# EasyEDA schematic ledring-final(easyEDA).json

## Sheets
1 Connections to Outside World: TITLE: Connections; REV: 1.0; Date: 2020-01-10; Sheet: 1/1; Drawn By: mbk7; Company: superLab(2020)
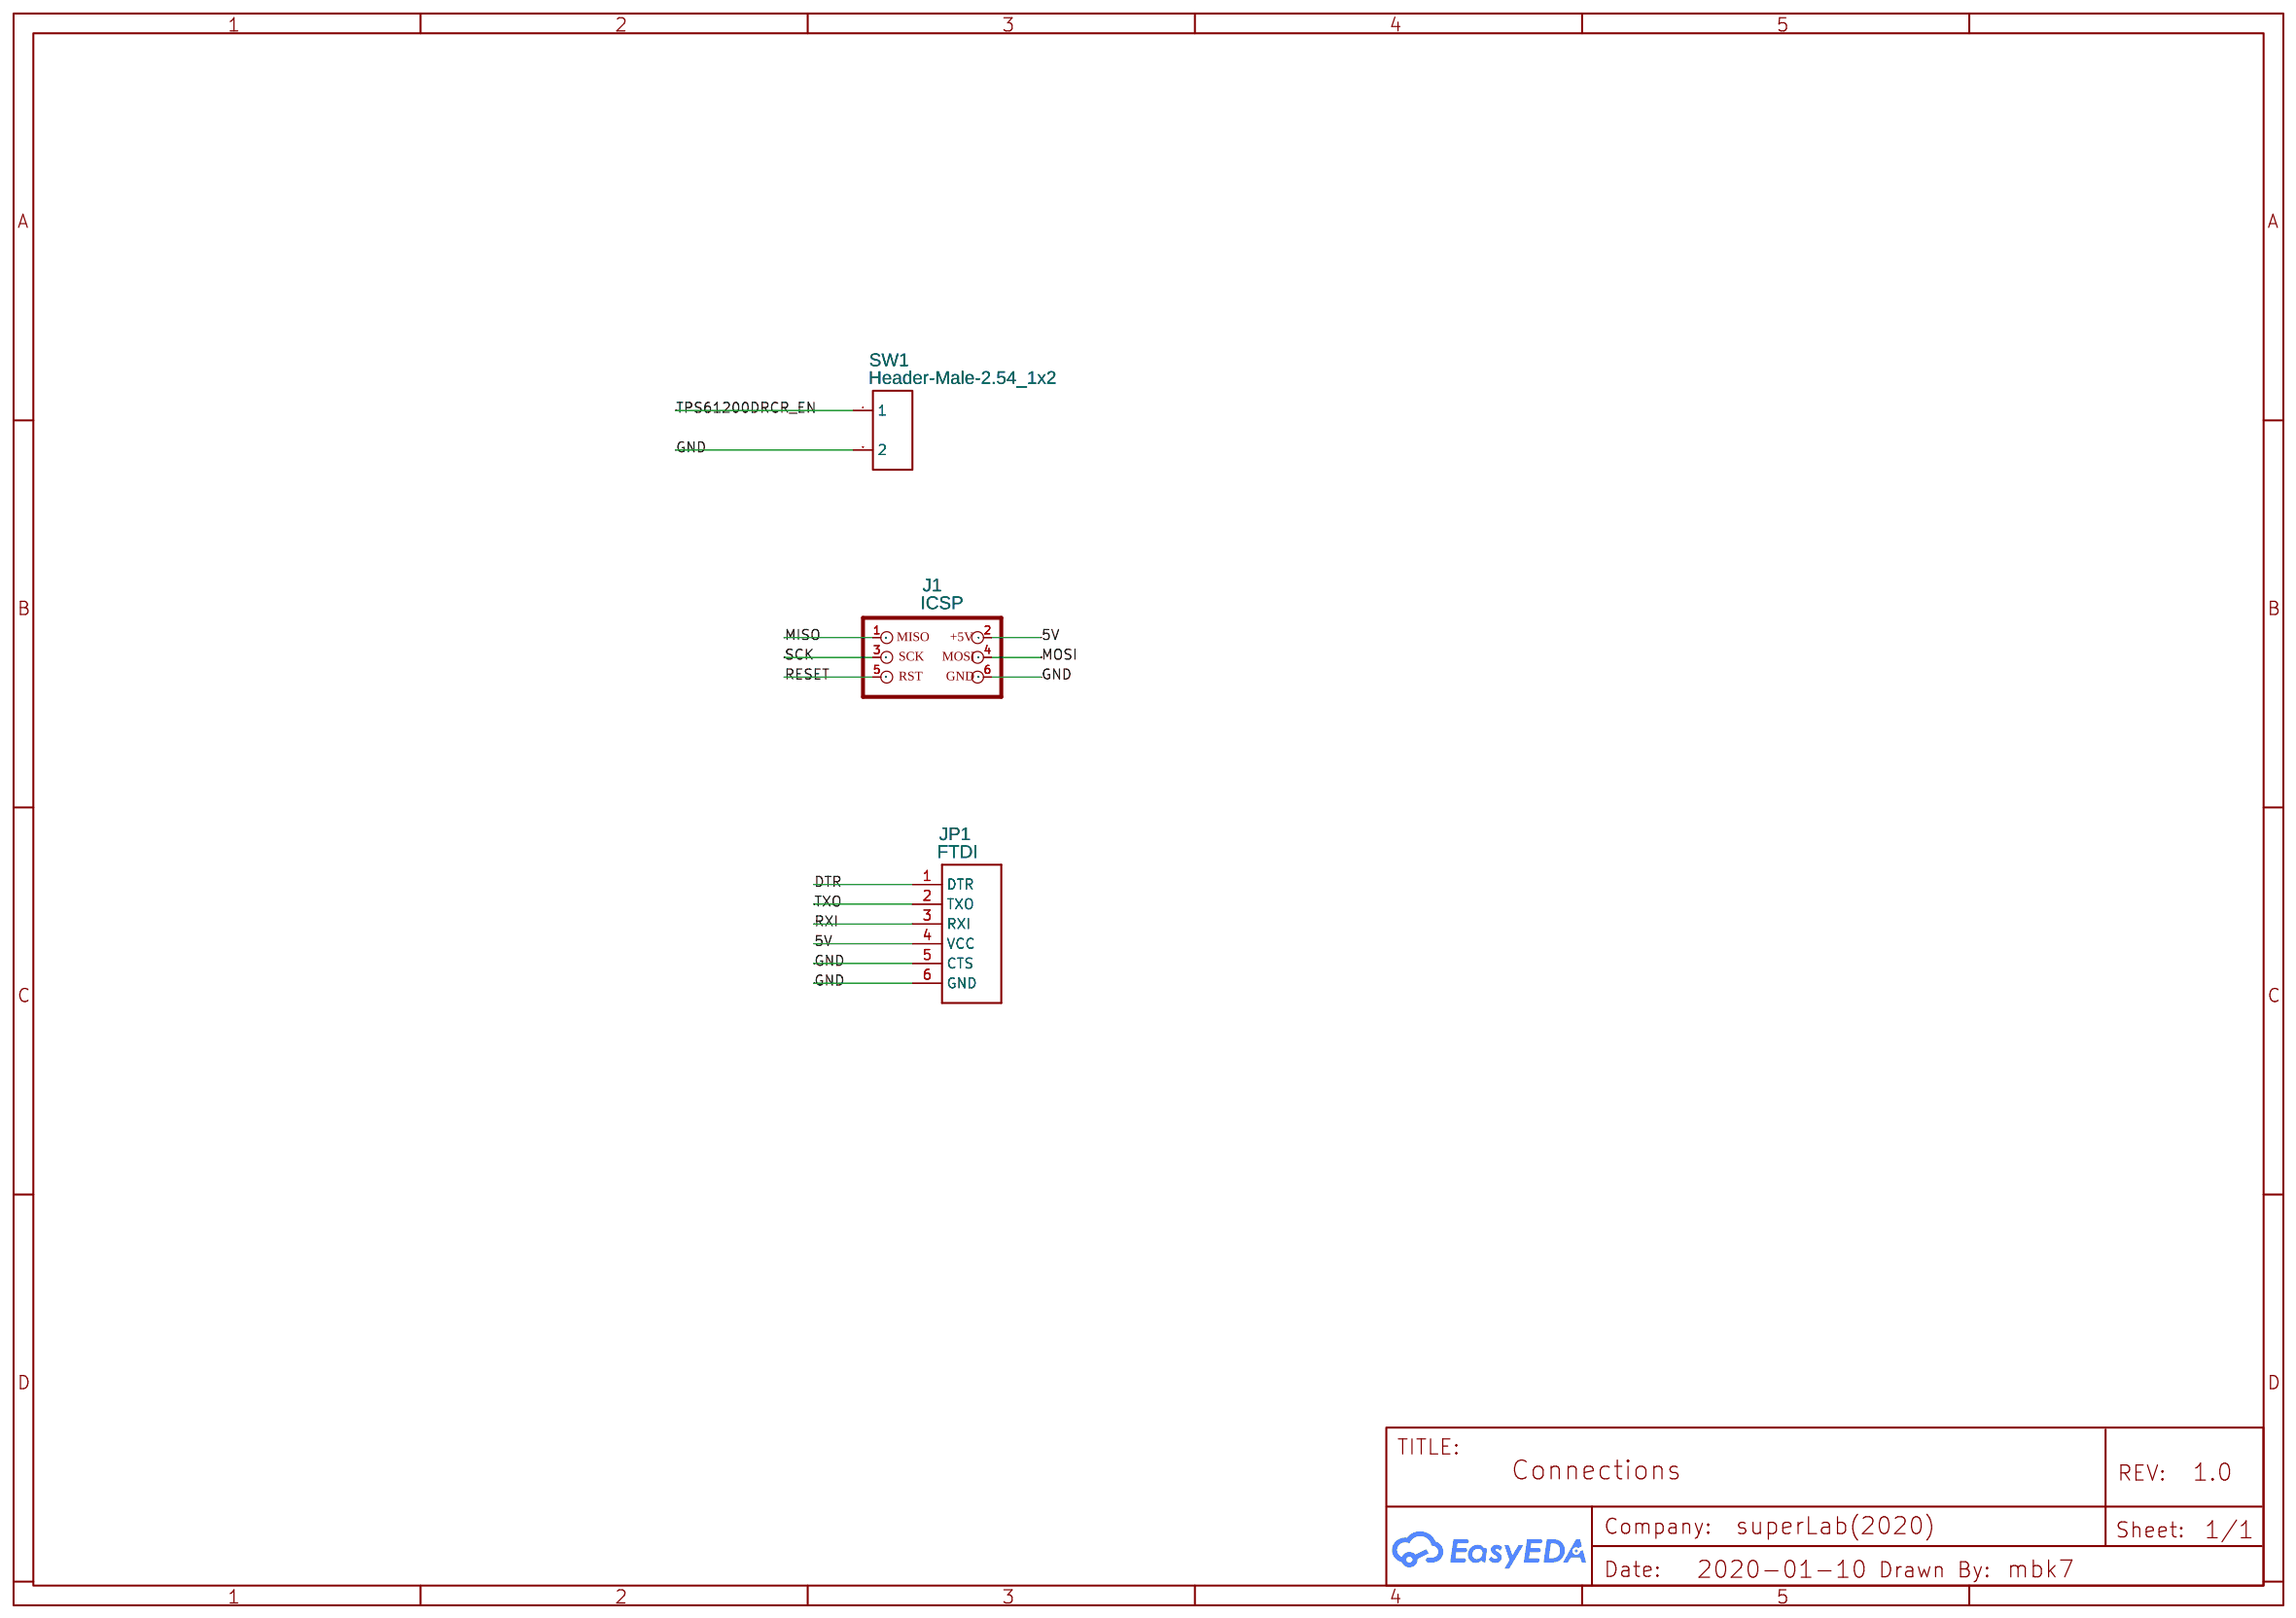
[diagram p0: Connections to Outside World]
2 Arduino: TITLE: Arduino Pro Mini
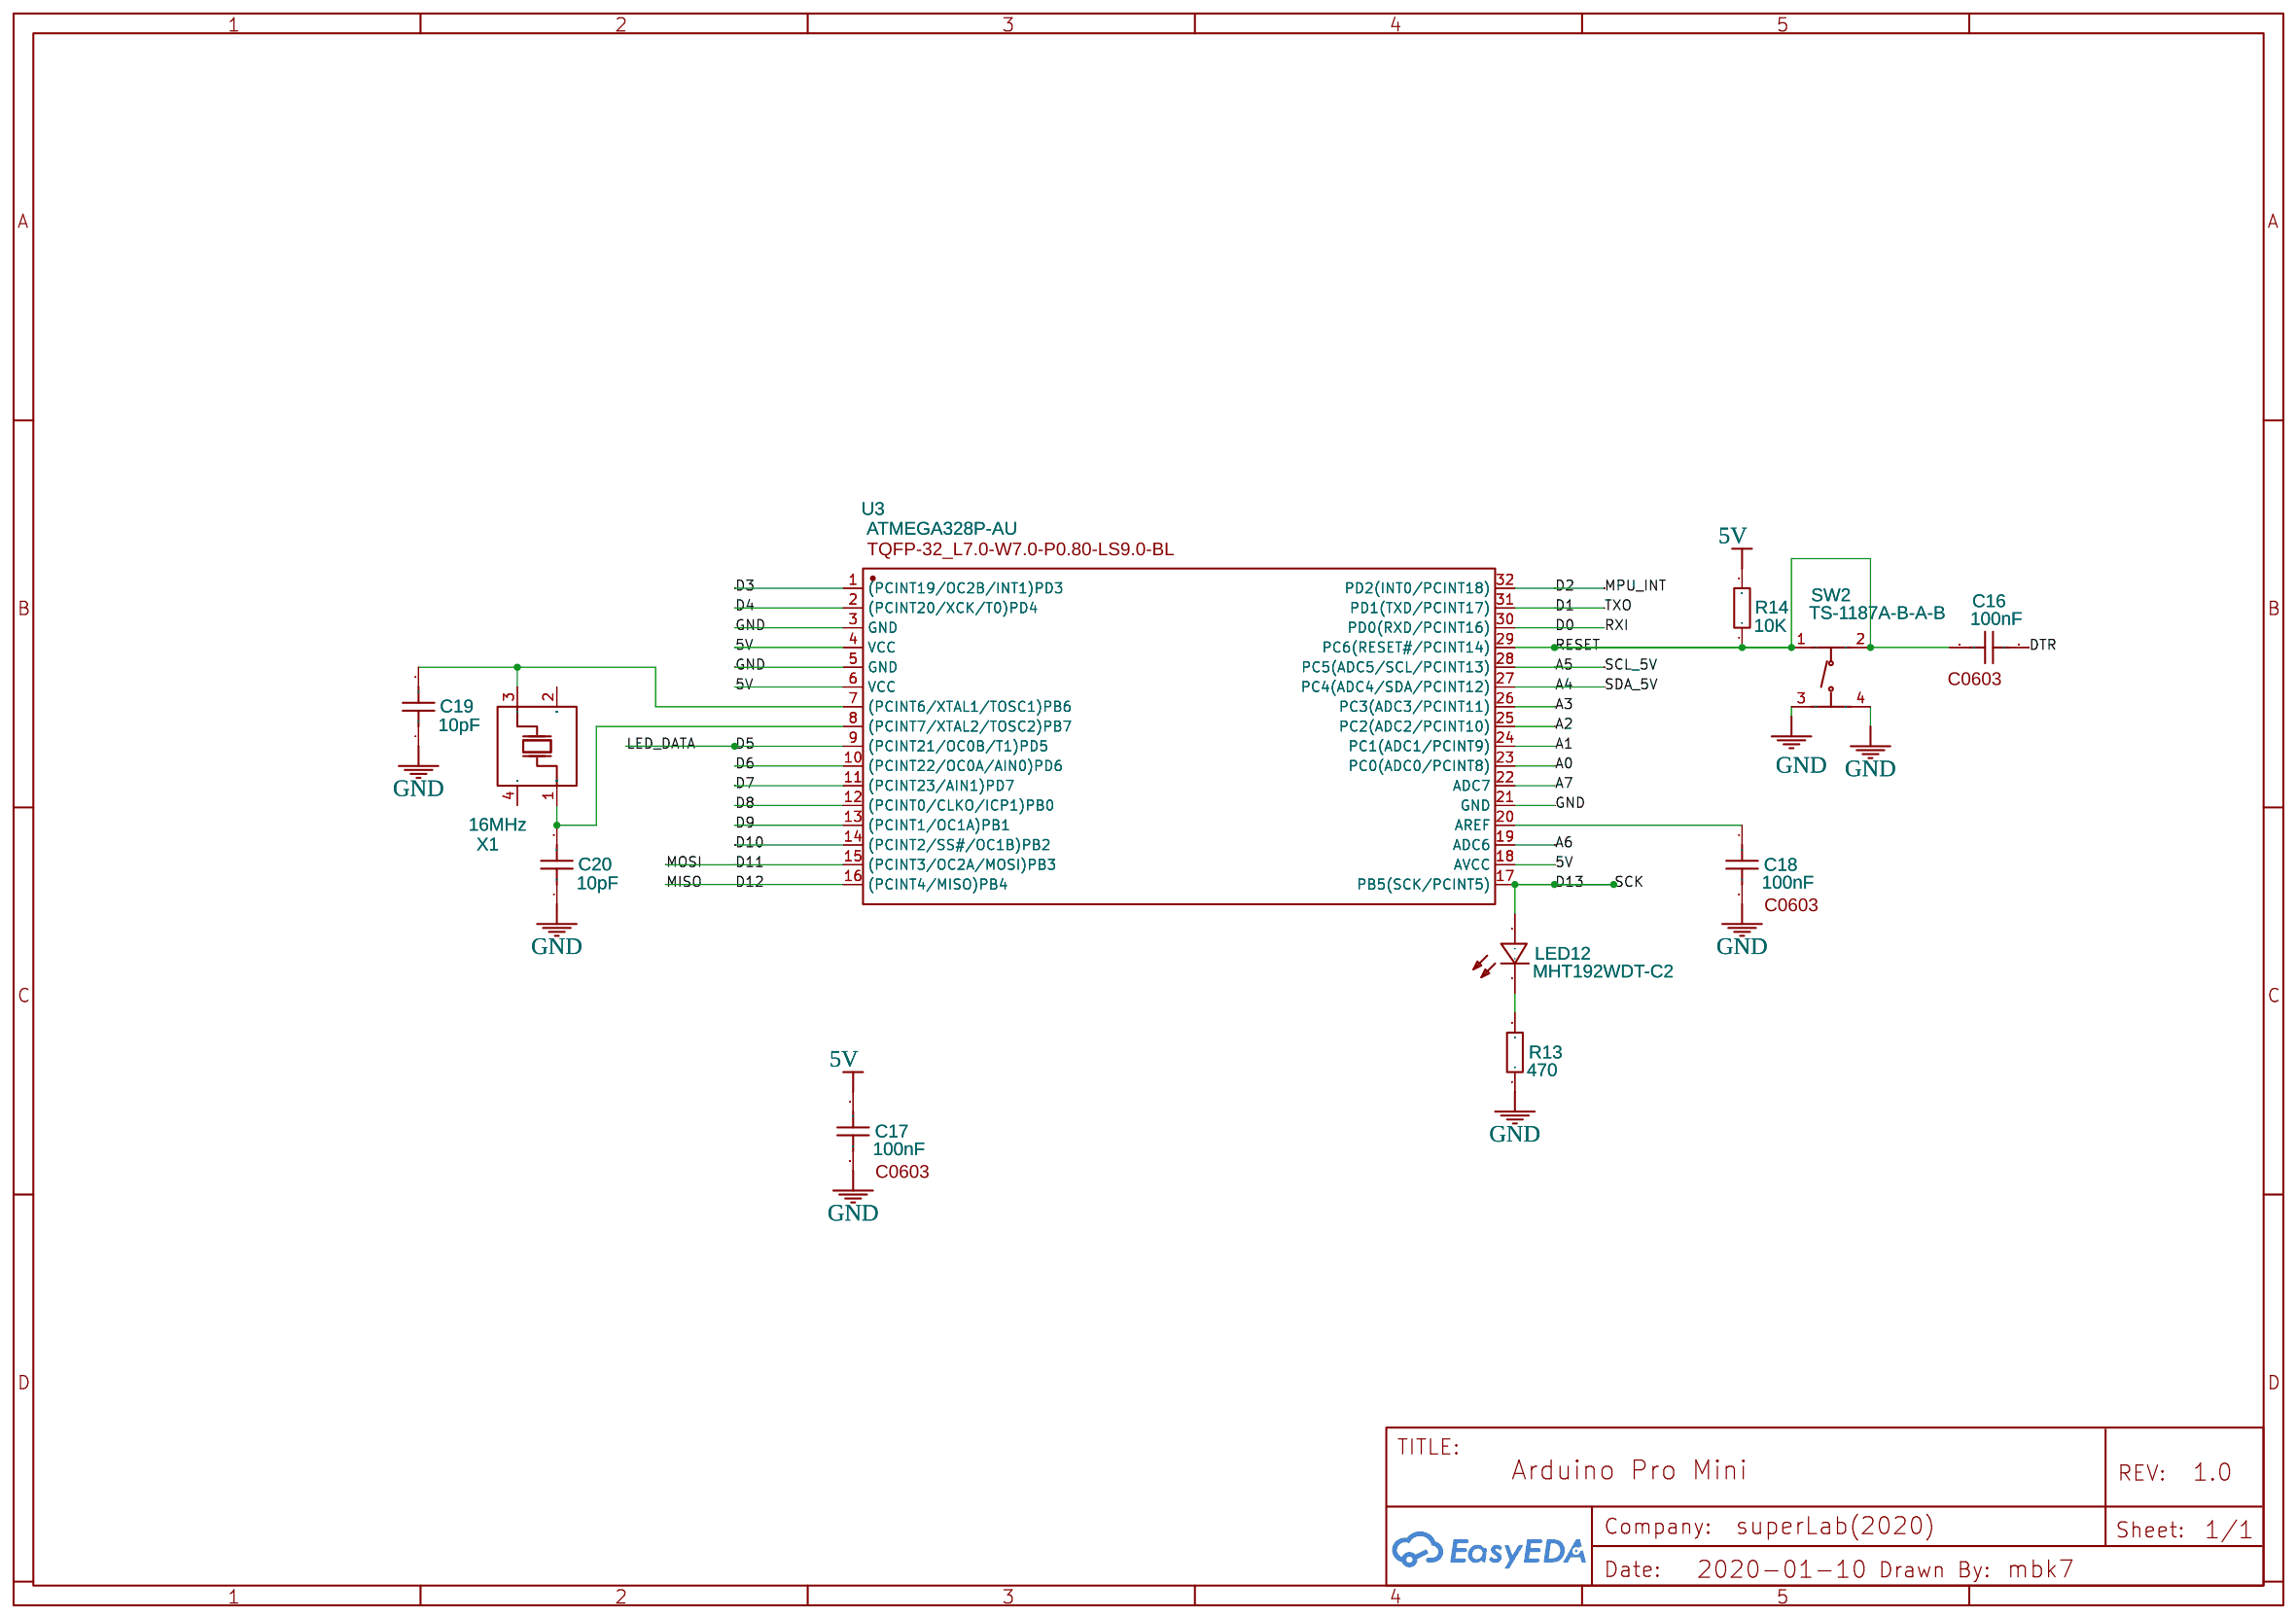
[diagram p1: Arduino]
3 I2C Shifting: TITLE: I2C Voltage Shifting
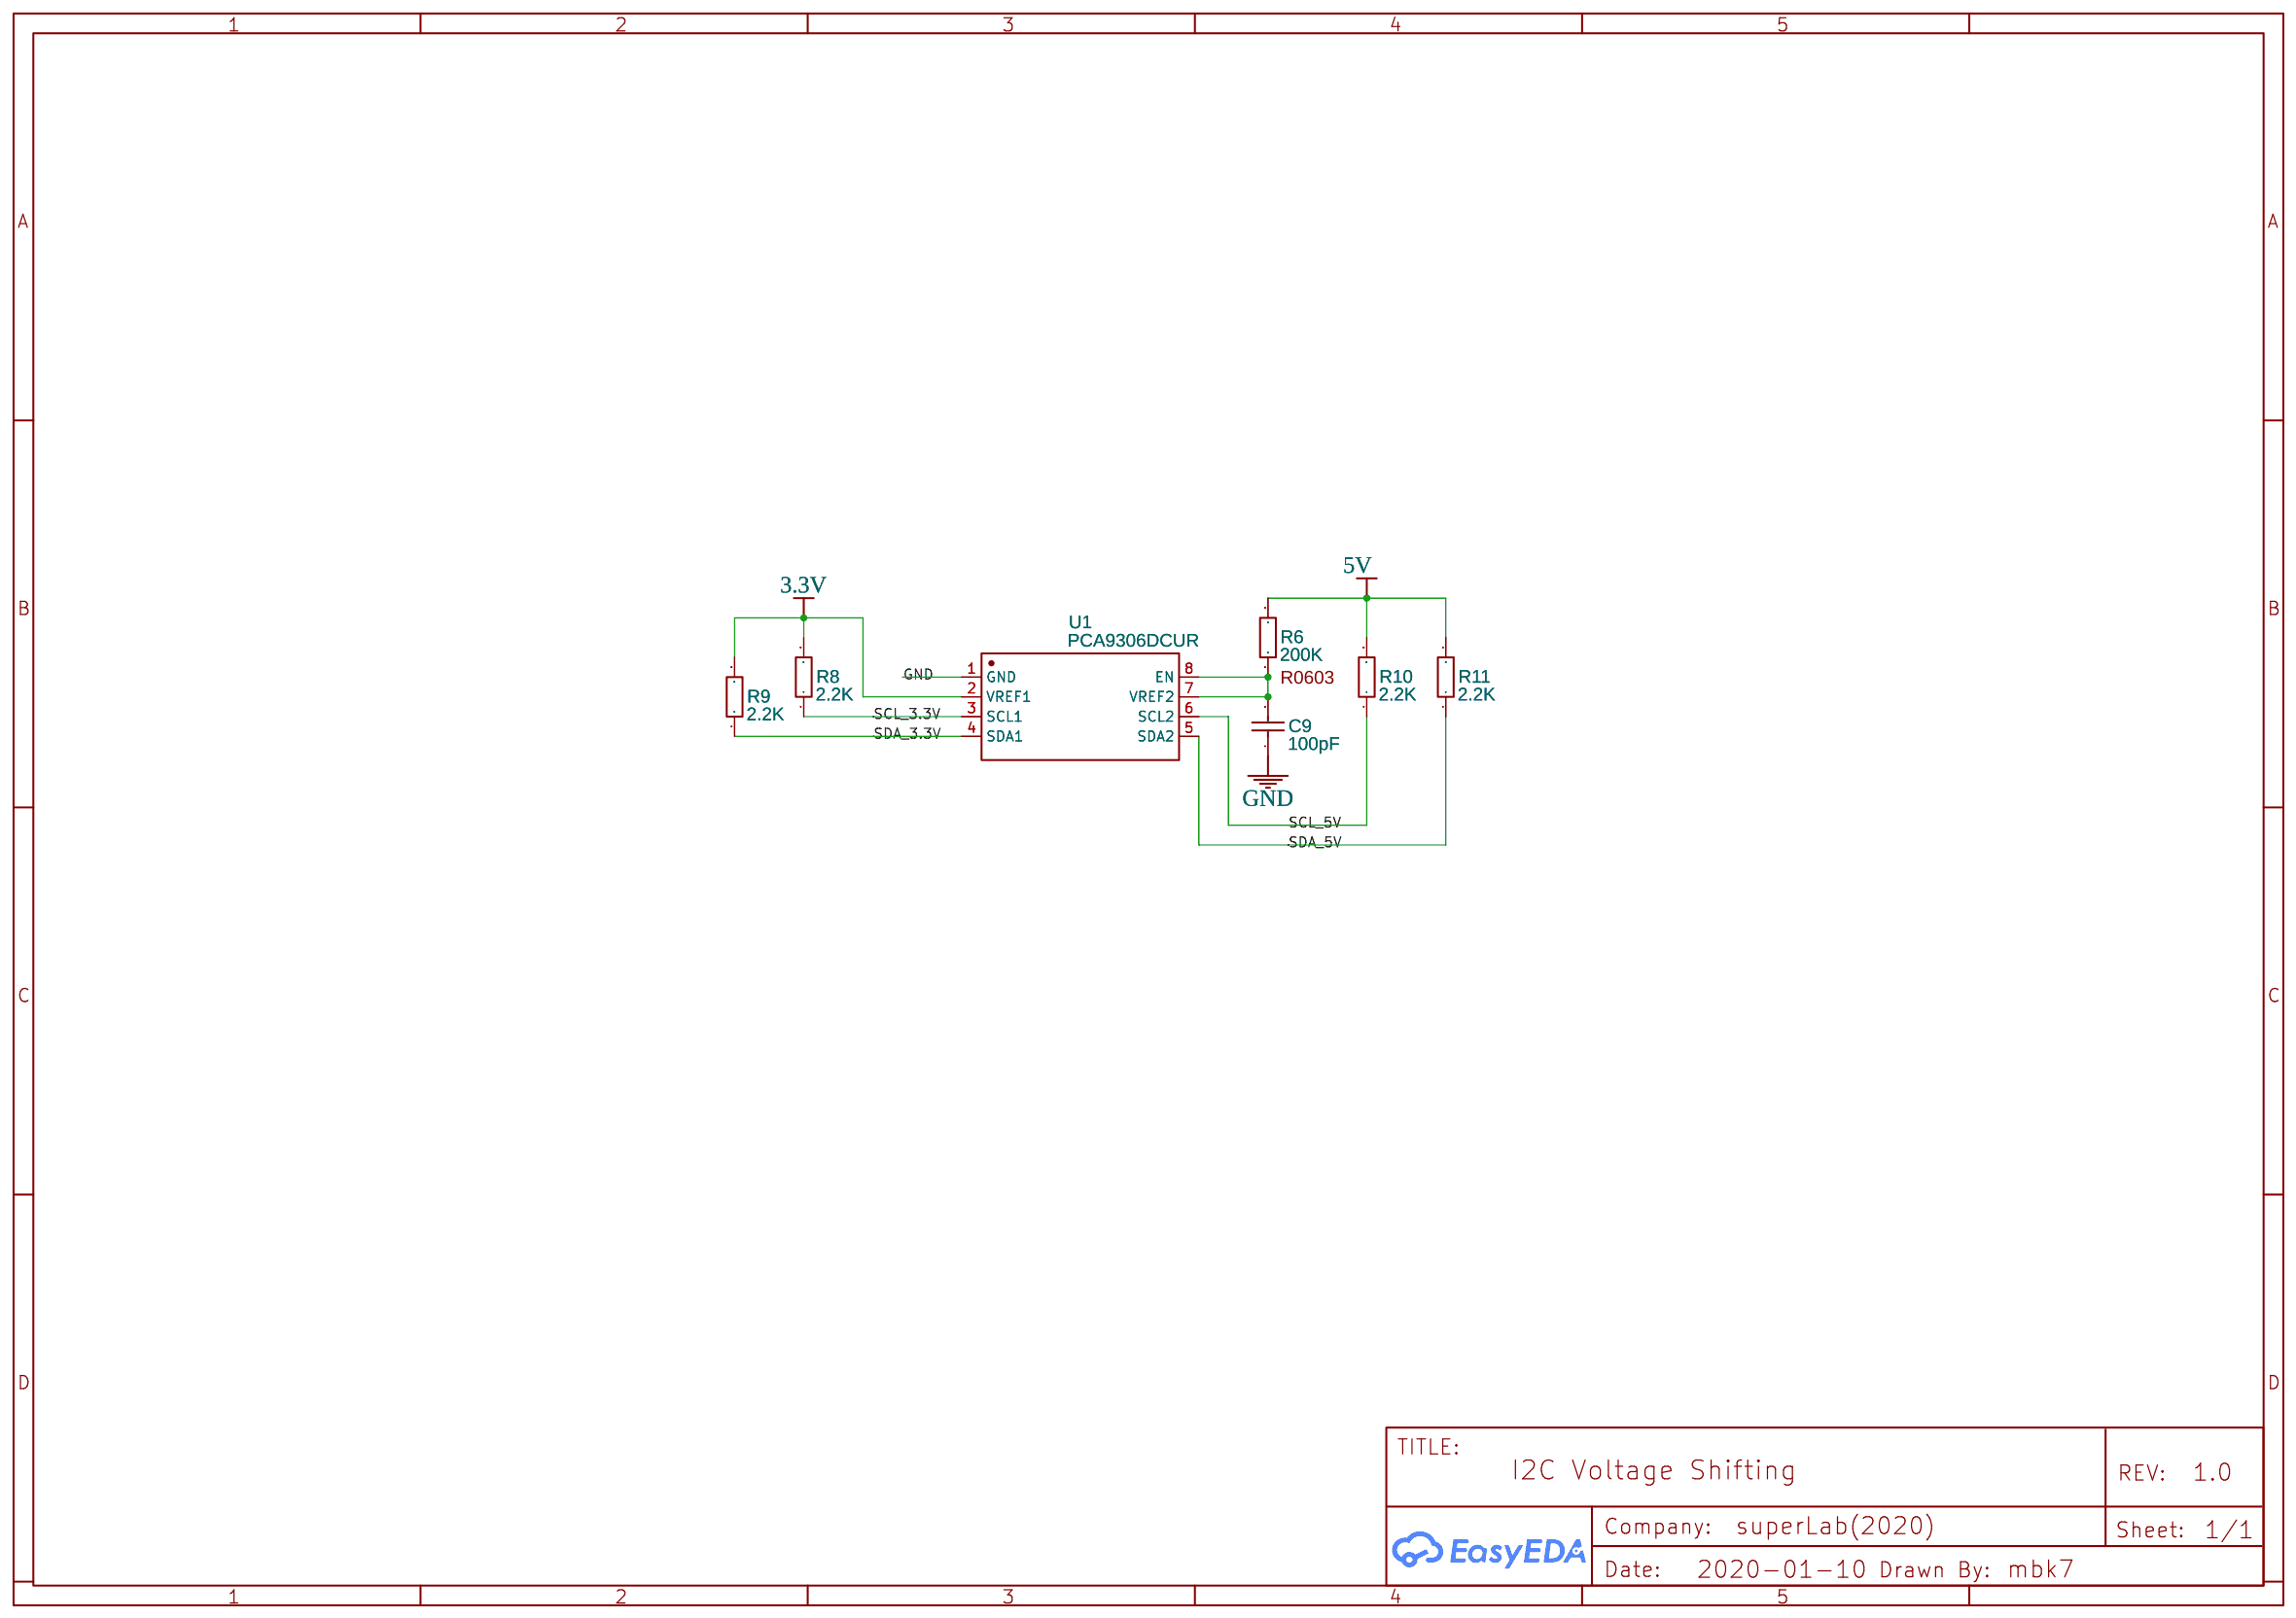
[diagram p2: I2C Shifting]
4 LEDs: TITLE: Neopixels
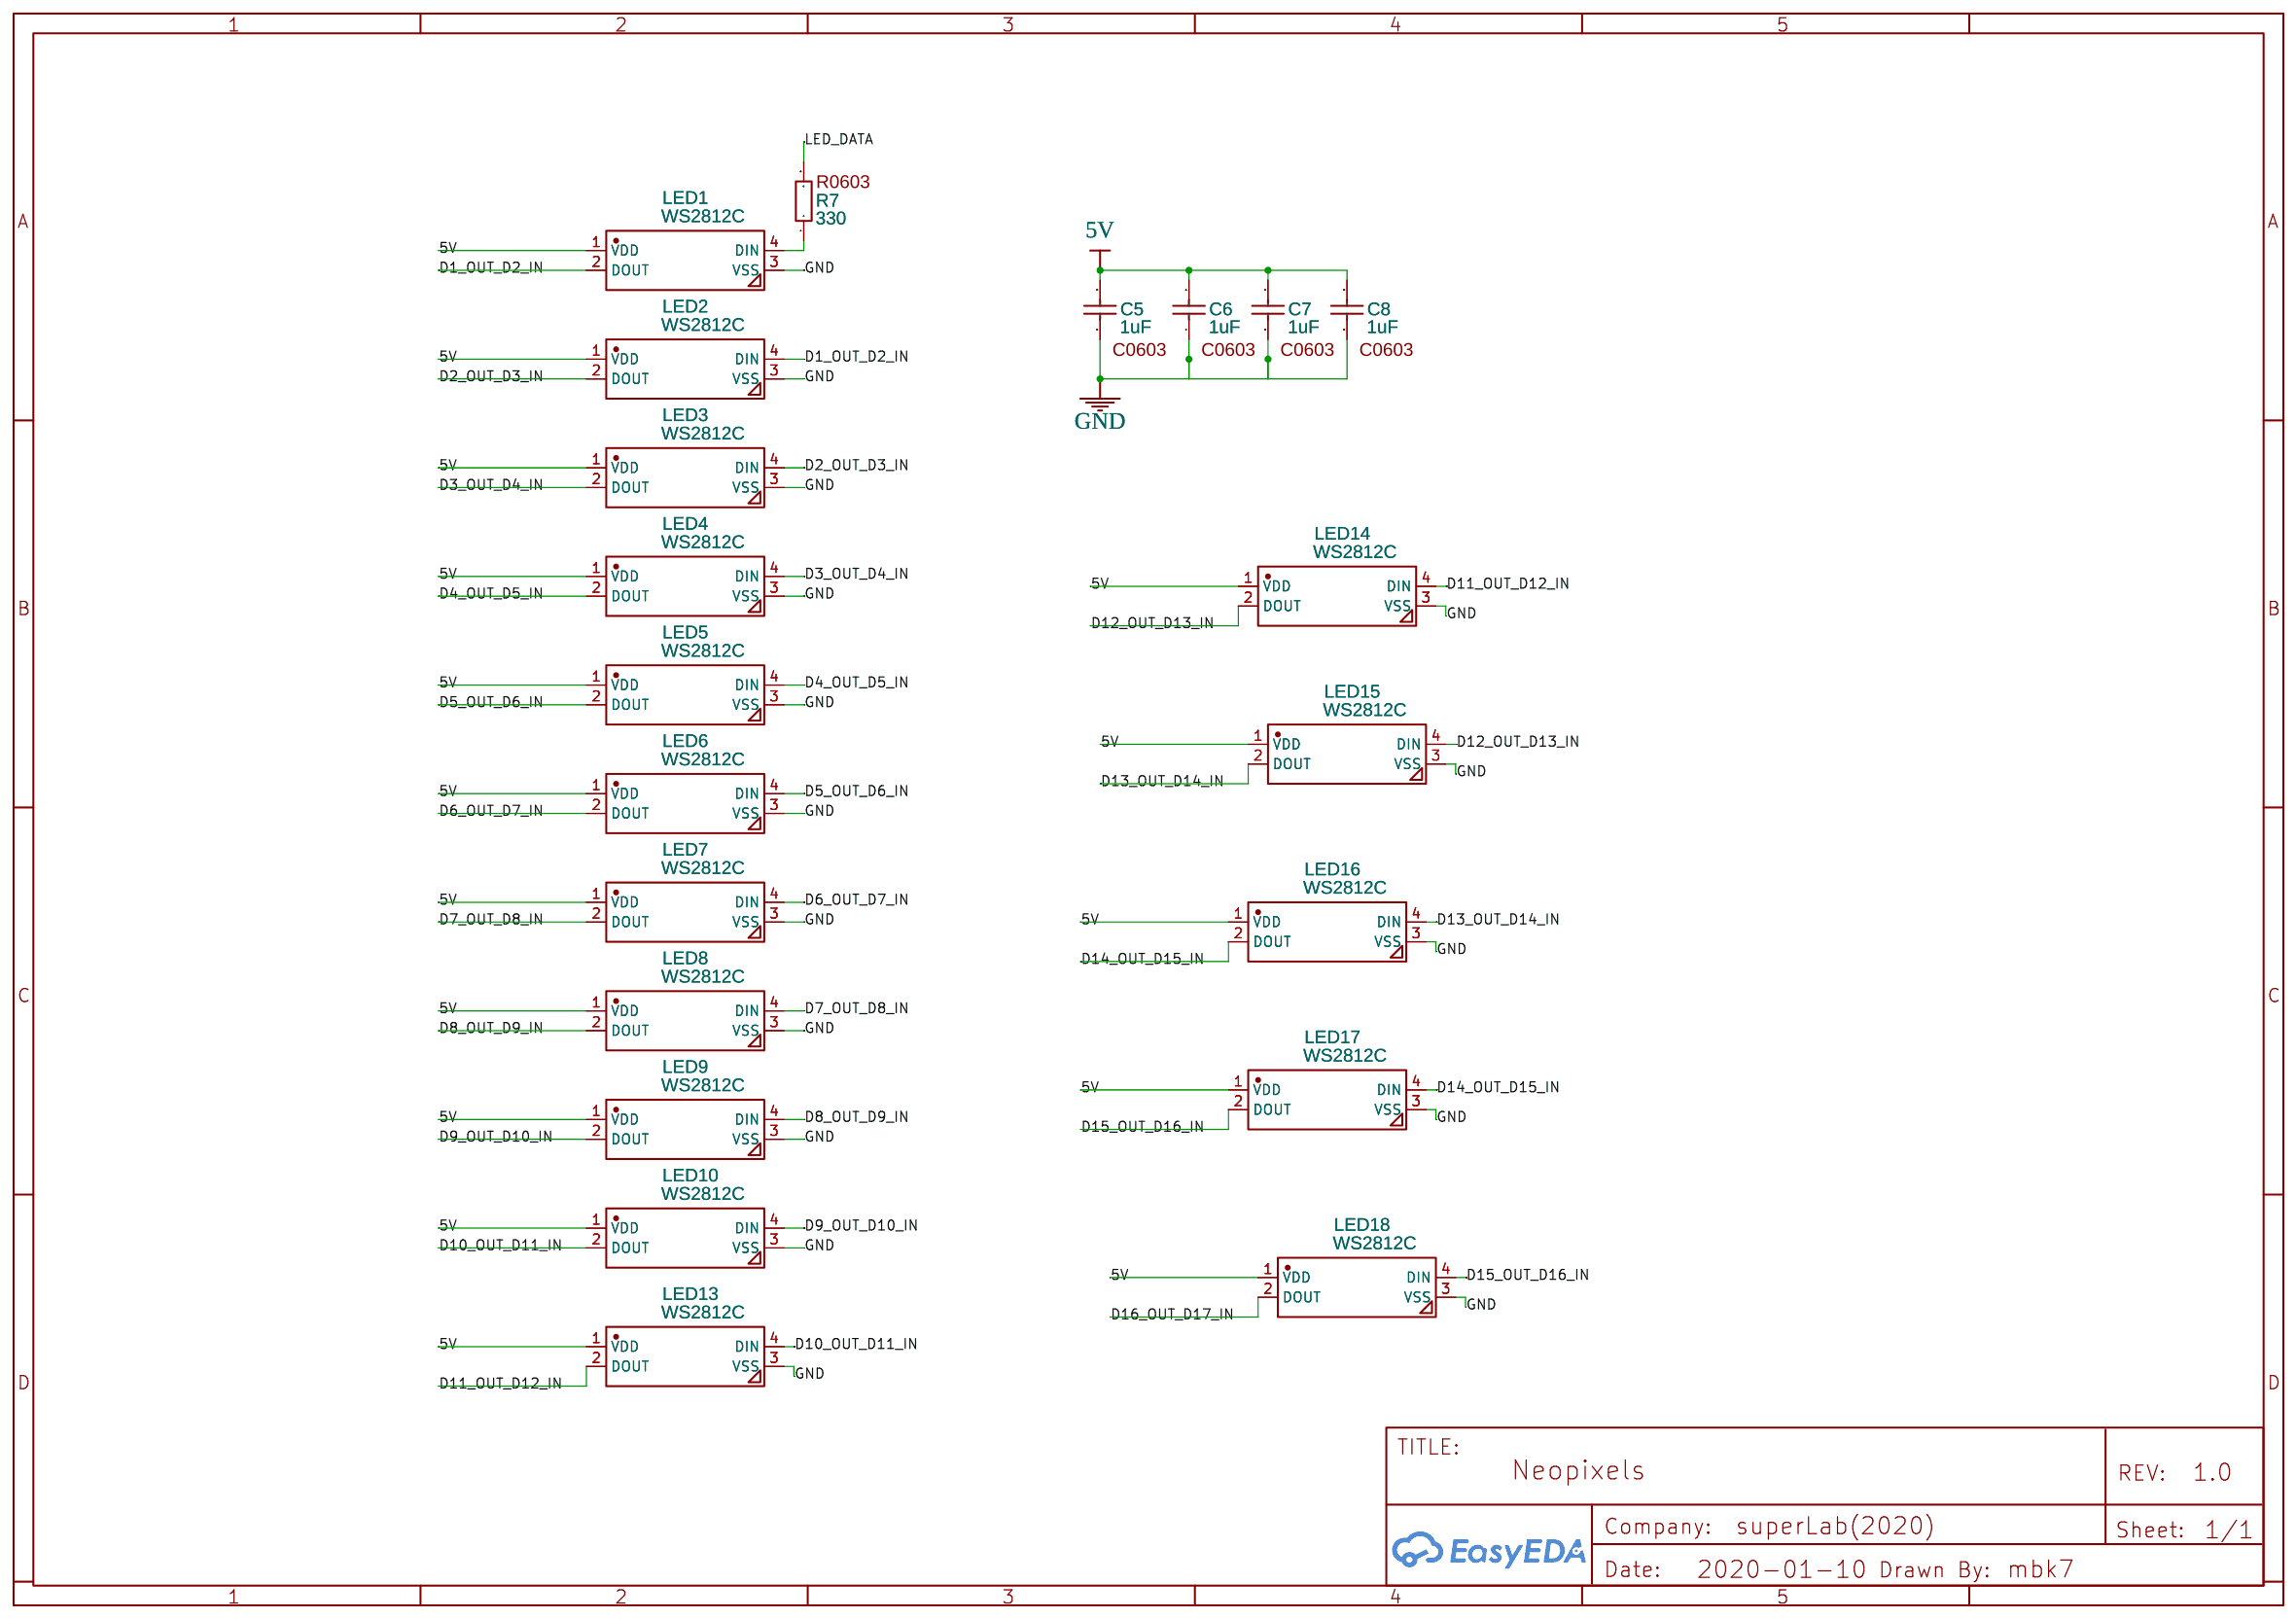
[diagram p3: LEDs]
5 MPU-6050: TITLE: MPU-6050
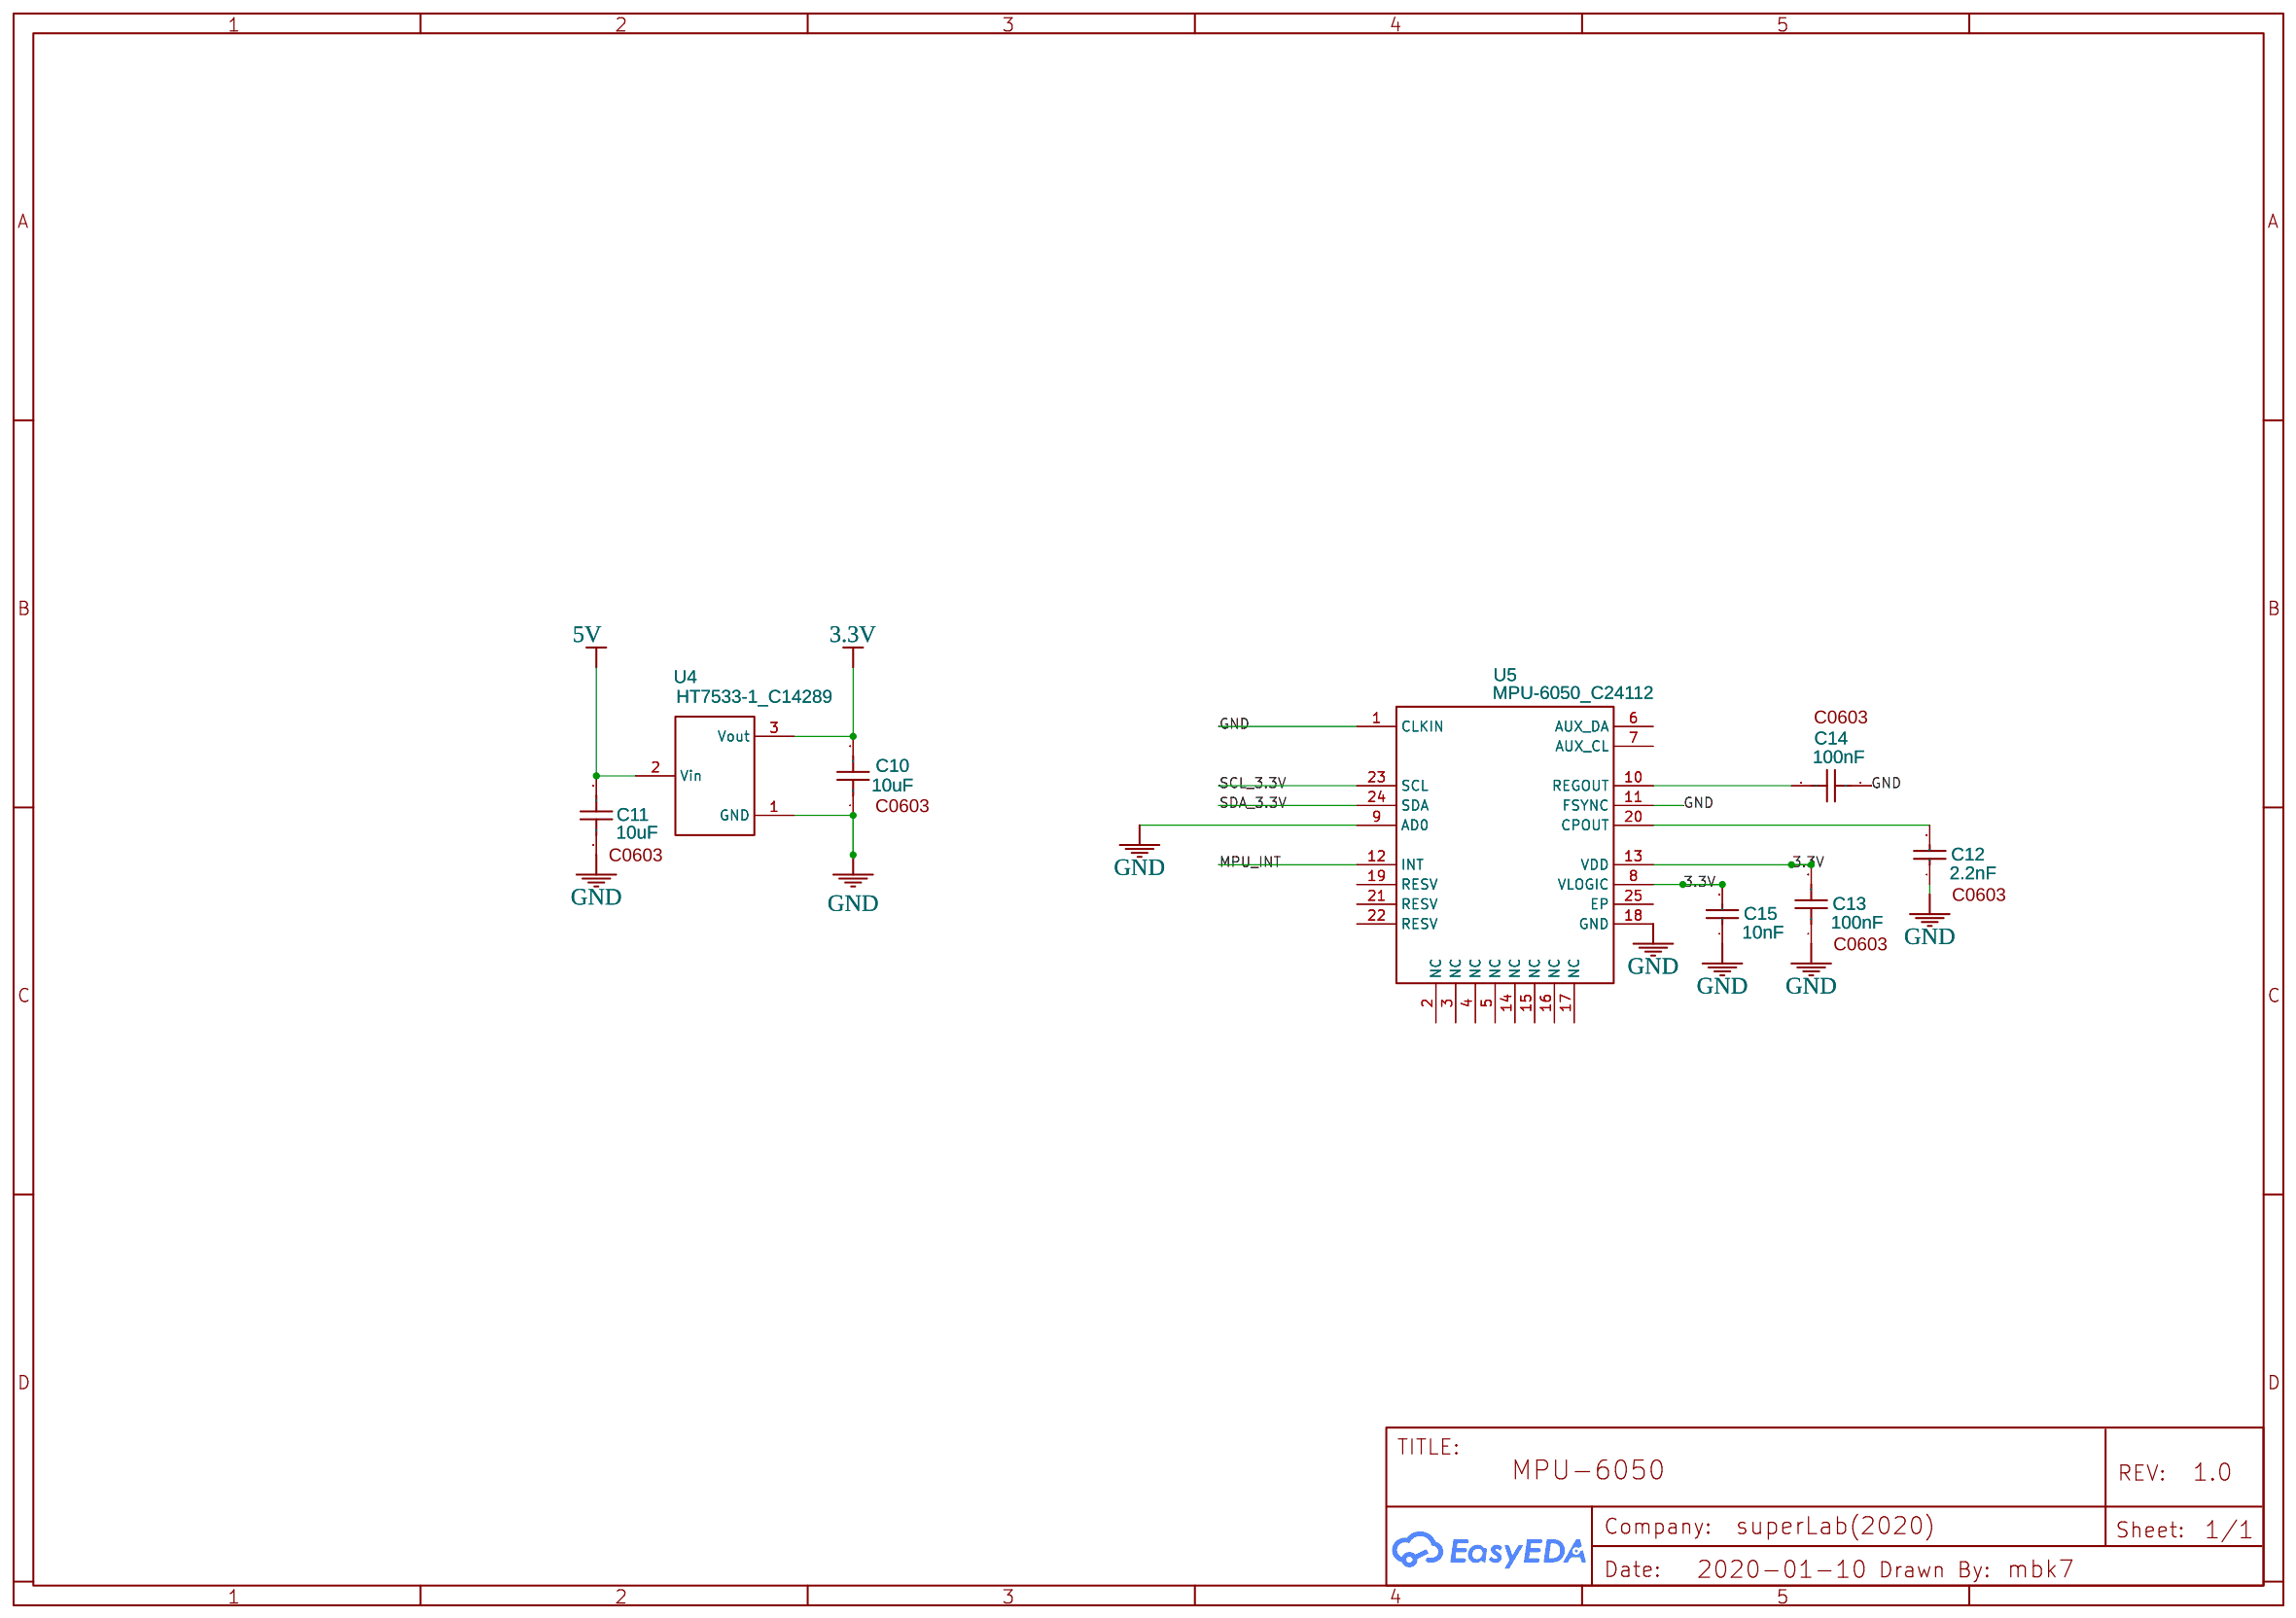
[diagram p4: MPU-6050]
6 Boost Power Supply: TITLE: Boost Power Supply
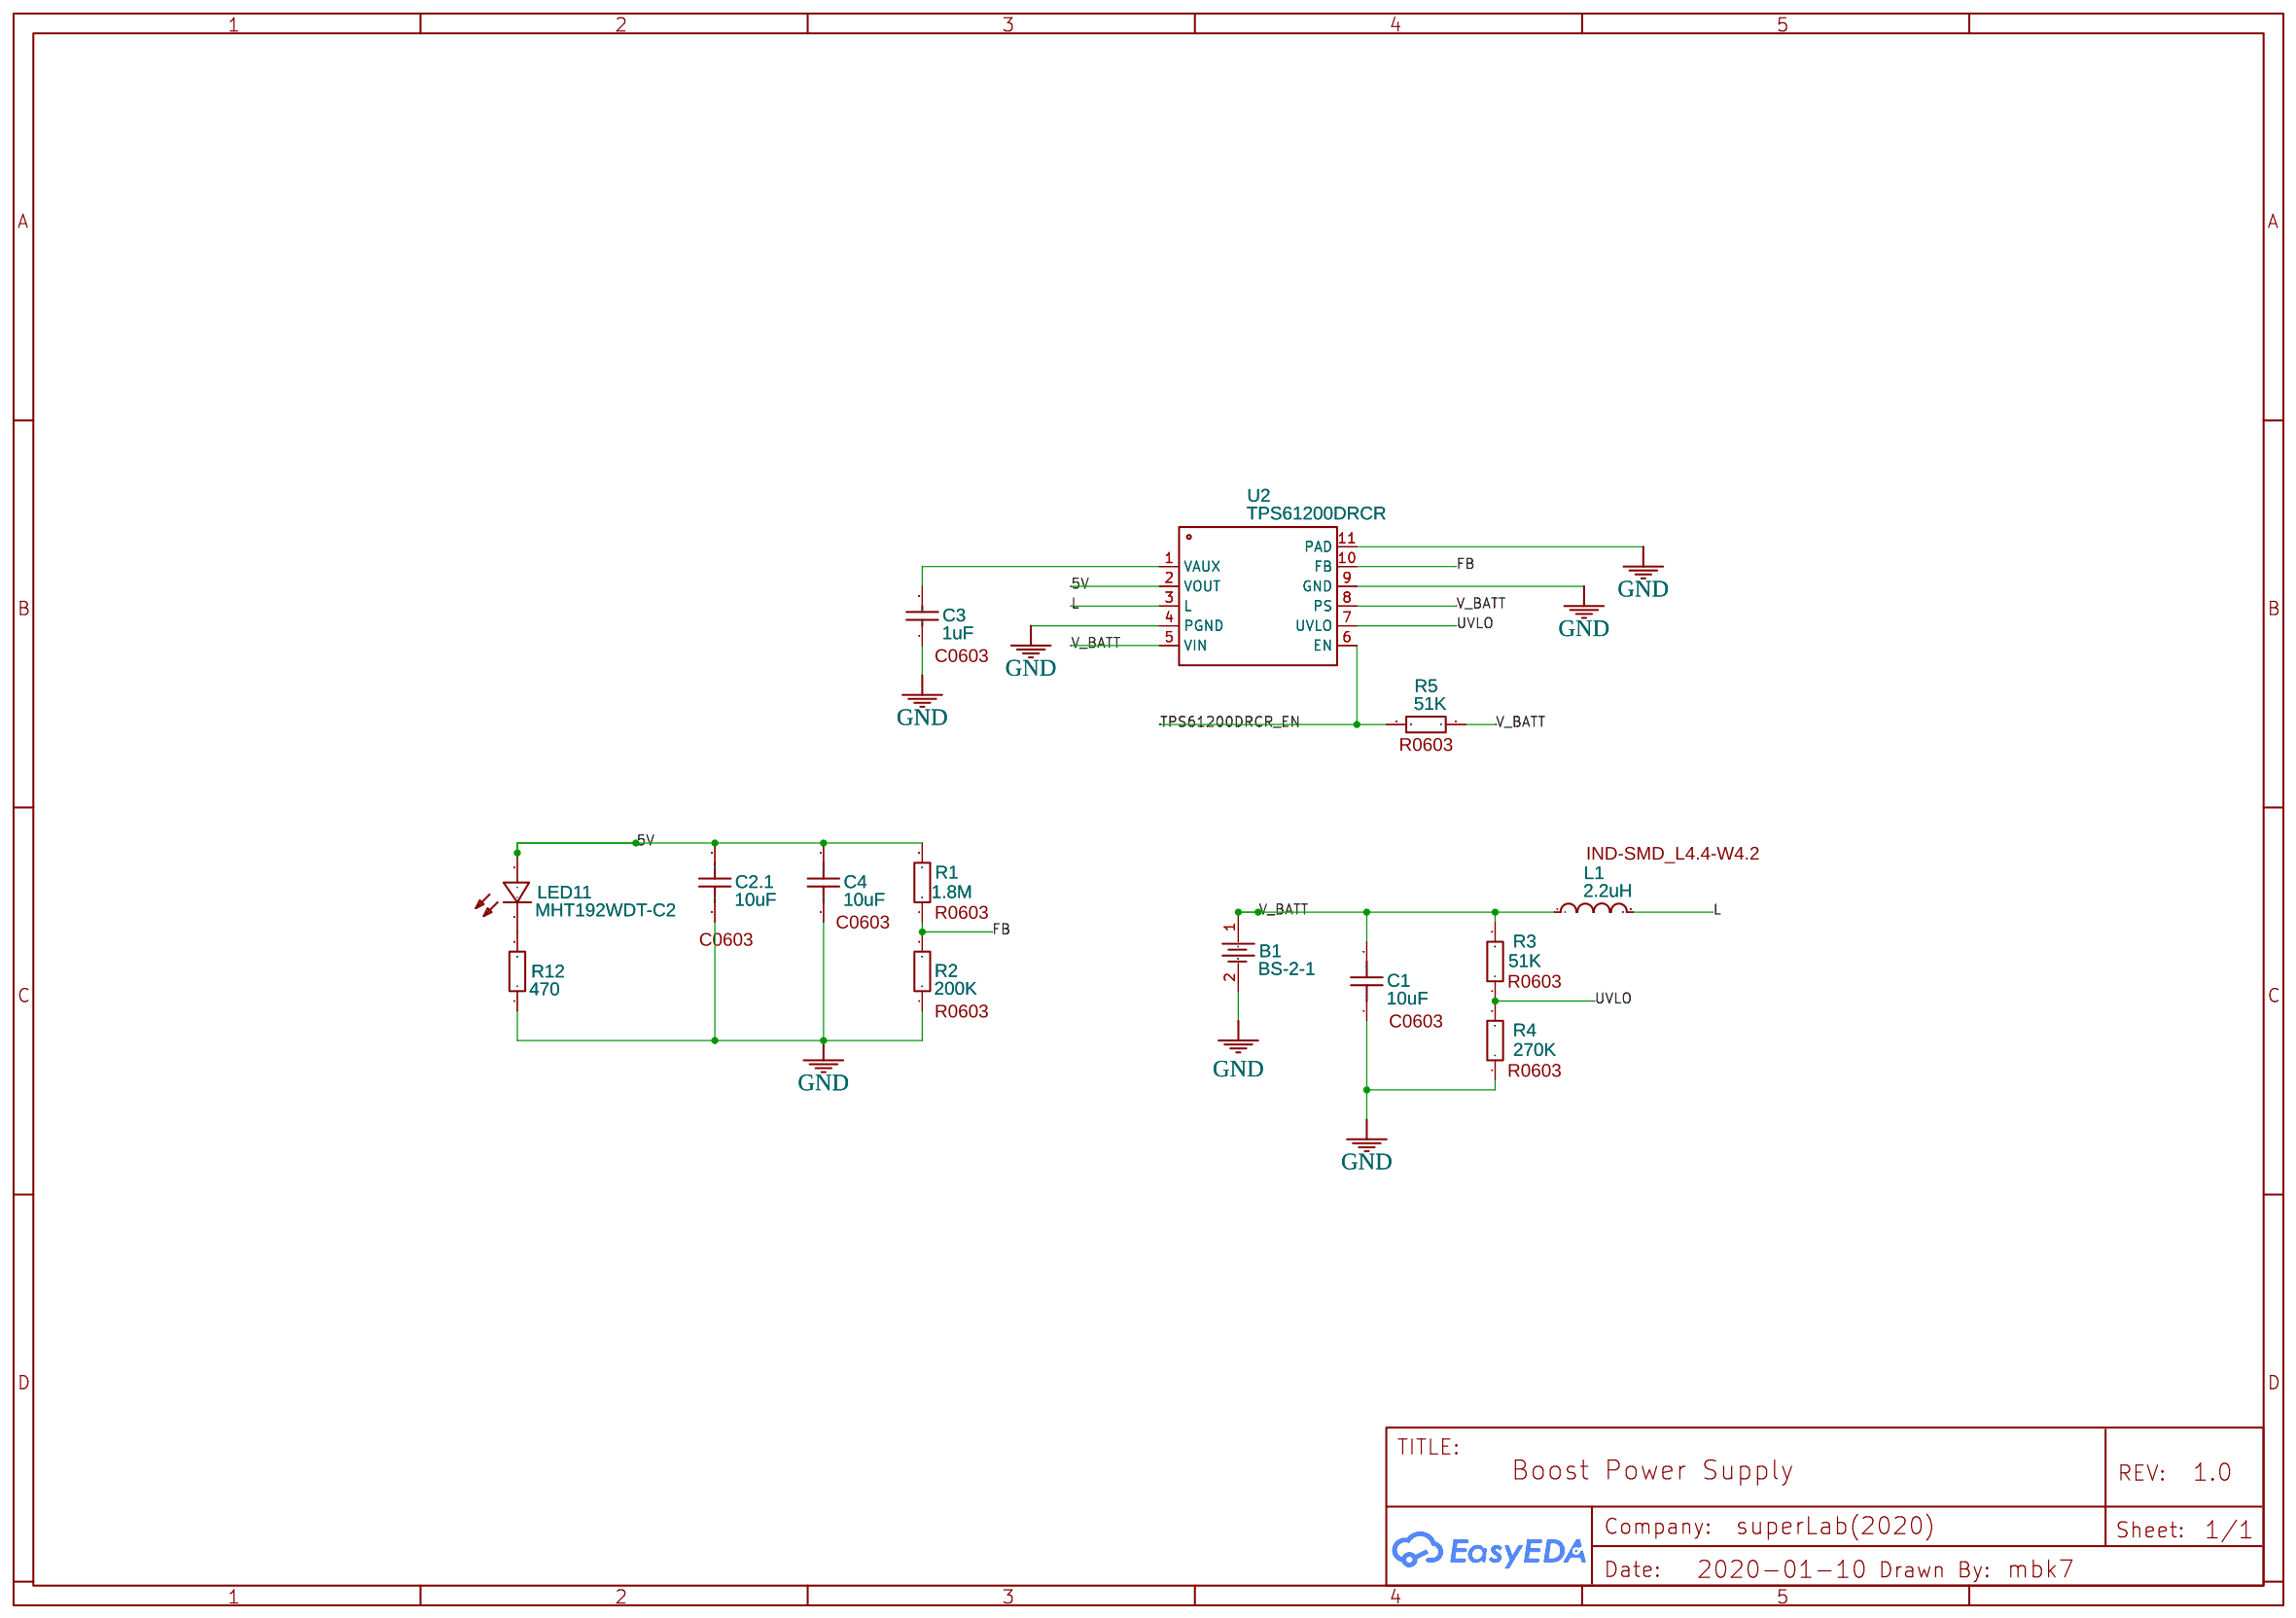
[diagram p5: Boost Power Supply]

## Parts
sheet Arduino
C16  100nF  [C0603]
C17  100nF  [C0603]
C18  100nF  [C0603]
C19  10pF  [C0402]
C20  10pF  [C0402]
LED12  MHT192WDT-C2  [LED0603-RD]
R13  470  [R0603]
R14  10K  [R0603]
SW2  TS-1187A-B-A-B  [SW-SMD_4P-L5.1-W5.1-P3.70-LS6.4]
U3  ATMEGA328P-AU  [TQFP-32_L7.0-W7.0-P0.80-LS9.0-BL]
X1  16MHz  [OSC-SMD_4P-L3.2-W2.5-BL]
sheet Boost Power Supply
B1  BS-2-1  [KEYSTONE_2466_1XAAA]
C1  10uF  [C0603]
C2  10uF  [C0603]  (section 1)
C3  1uF  [C0603]
C4  10uF  [C0603]
L1  2.2uH  [IND-SMD_L4.4-W4.2]
LED11  MHT192WDT-C2  [LED0603-RD]
R1  1.8M  [R0603]
R2  200K  [R0603]
R3  51K  [R0603]
R4  270K  [R0603]
R5  51K  [R0603]
R12  470  [R0603]
U2  TPS61200DRCR  [VSON-10_L3.0-W3.0-P0.50-BL-EP_TPS62410DRCR]
sheet Connections to Outside World
J1  ICSP  [HEADER_PRG_2X03]
JP1  FTDI  [FTDI]
SW1  Header-Male-2.54_1x2  [HDR-2X1/2.54]
sheet I2C Shifting
C9  100pF  [C0402]
R6  200K  [R0603]
R8  2.2K  [R0402]
R9  2.2K  [R0402]
R10  2.2K  [R0402]
R11  2.2K  [R0402]
U1  PCA9306DCUR  [VSSOP-8_L2.4-W2.1-P0.50-LS3.2-BL]
sheet LEDs
C5  1uF  [C0603]
C6  1uF  [C0603]
C7  1uF  [C0603]
C8  1uF  [C0603]
LED1  WS2812C  [LED-SMD_4P-L5.0-W5.0-BL]
LED2  WS2812C  [LED-SMD_4P-L5.0-W5.0-BL]
LED3  WS2812C  [LED-SMD_4P-L5.0-W5.0-BL]
LED4  WS2812C  [LED-SMD_4P-L5.0-W5.0-BL]
LED5  WS2812C  [LED-SMD_4P-L5.0-W5.0-BL]
LED6  WS2812C  [LED-SMD_4P-L5.0-W5.0-BL]
LED7  WS2812C  [LED-SMD_4P-L5.0-W5.0-BL]
LED8  WS2812C  [LED-SMD_4P-L5.0-W5.0-BL]
LED9  WS2812C  [LED-SMD_4P-L5.0-W5.0-BL]
LED10  WS2812C  [LED-SMD_4P-L5.0-W5.0-BL]
LED13  WS2812C  [LED-SMD_4P-L5.0-W5.0-BL]
LED14  WS2812C  [LED-SMD_4P-L5.0-W5.0-BL]
LED15  WS2812C  [LED-SMD_4P-L5.0-W5.0-BL]
LED16  WS2812C  [LED-SMD_4P-L5.0-W5.0-BL]
LED17  WS2812C  [LED-SMD_4P-L5.0-W5.0-BL]
LED18  WS2812C  [LED-SMD_4P-L5.0-W5.0-BL]
R7  330  [R0603]
sheet MPU-6050
C10  10uF  [C0603]
C11  10uF  [C0603]
C12  2.2nF  [C0603]
C13  100nF  [C0603]
C14  100nF  [C0603]
C15  10nF  [C0603]
U4  HT7533-1_C14289  [SOT-89-3_L4.5-W2.5-P1.50-LS4.2-BR]
U5  MPU-6050_C24112  [QFN-24_4X4X05P]

## Library data of the parts
C13 C14 C16-C18 = CC0603KRX7R9BB104: Supplier: LCSC; Manufacturer: YAGEO; LCSC Assembly: Yes; Supplier Part: C14663; SMT Type: Basic; Package Display: Yes
C19 C20 = CL05C100JB5NNNC: Supplier: LCSC; Manufacturer: SAMSUNG; LCSC Assembly: Yes; Supplier Part: C32949; SMT Type: Basic
LED11 LED12 = MHT192WDT-C2: Supplier: LCSC; Supplier Part: C389521; Manufacturer: MEIHUA; Contributor: LCSC
R12 R13 = 0603WAF4700T5E: Supplier: LCSC; Manufacturer: UniOhm; LCSC Assembly: Yes; Supplier Part: C23179; SMT Type: Basic
R14 = 0603WAF1002T5E: Supplier: LCSC; Manufacturer: UniOhm; LCSC Assembly: Yes; Supplier Part: C25804; SMT Type: Basic
SW2 = TS-1187A-B-A-B: Supplier: LCSC; Supplier Part: C318884; Manufacturer: XKB Enterprise; Contributor: LCSC
U3 = ATMEGA328P-AU: Supplier: LCSC; Manufacturer: MICROCHIP; image: //image.lceda.cn/szlcsc/C14877.jpg; Supplier Part: C14877; LCSC Assembly: Yes; SMT Type: Extend; Package Display: Yes
X1 = X322516MLB4SI: Supplier: LCSC; Manufacturer: YXC; LCSC Assembly: Yes; Supplier Part: C13738; SMT Type: Basic
B1 = BS-2-1: Supplier: LCSC; Manufacturer: Q&J; image: //image.lceda.cn/szlcsc/C70376.jpg; Supplier Part: C70376
C1 C2 C4 C10 C11 = CL10A106KP8NNNC: Supplier: LCSC; Manufacturer: SAMSUNG; LCSC Assembly: Yes; Supplier Part: C19702; SMT Type: Basic; Package Display: Yes
C3 C5-C8 = CL10A105KB8NNNC: Supplier: LCSC; Manufacturer: SAMSUNG; LCSC Assembly: Yes; Supplier Part: C15849; SMT Type: Basic; Package Display: Yes
L1 = MWSA0402-2R2MT: Supplier: LCSC; Manufacturer: Sunlord; Contributor: LCSC; Supplier Part: C169184; Package Display: Yes
R1 = 0603WAF1804T5E: Supplier: LCSC; Manufacturer: UniOhm; Supplier Part: C13318; LCSC Assembly: Yes; SMT Type: Extend; Package Display: Yes
R2 R6 = 0603WAF2003T5E: Supplier: LCSC; Manufacturer: UniOhm; LCSC Assembly: Yes; Supplier Part: C25811; SMT Type: Basic; Package Display: Yes
R3 R5 = 0603WAF5102T5E: Supplier: LCSC; Manufacturer: UniOhm; LCSC Assembly: Yes; Supplier Part: C23196; SMT Type: Basic; Package Display: Yes
R4 = 0603WAF2703T5E: Supplier: LCSC; Manufacturer: UniOhm; LCSC Assembly: Yes; Supplier Part: C22965; SMT Type: Basic; Package Display: Yes
U2 = TPS61200DRCR: Supplier: LCSC; Supplier Part: C140320; Manufacturer: Texas Instruments; Contributor: LCSC
J1 = ICSP: Contributor: Gareth Burrows
JP1 = FTDI: Contributor: fukssvans
SW1 = Header-Male-2.54_1x2: Supplier: LCSC; Manufacturer: TE Connectivity; Manufacturer Part: 826629-2; image: //image.lceda.cn/szlcsc/C86471.jpg; Supplier Part: C86471
C9 = 0402CG101J500NT: Supplier: LCSC; Manufacturer: FH; LCSC Assembly: Yes; Supplier Part: C1546; SMT Type: Basic
R8-R11 = 0402WGF2201TCE: Supplier: LCSC; Manufacturer: UniOhm; LCSC Assembly: Yes; Supplier Part: C25879; SMT Type: Basic
U1 = PCA9306DCUR: Supplier: LCSC; Manufacturer: TI; image: //image.lceda.cn/szlcsc/C33196.jpg; Supplier Part: C33196; LCSC Assembly: Yes; SMT Type: Extend
LED1-LED10 LED13-LED18 = WS2812C: Supplier: LCSC; Manufacturer: Worldsemi; Contributor: LCSC; Supplier Part: C114587
R7 = 0603WAF3300T5E: Supplier: LCSC; Manufacturer: UniOhm; LCSC Assembly: Yes; Supplier Part: C23138; SMT Type: Basic; Package Display: Yes
C12 = 0603B222K500NT: Supplier: LCSC; Manufacturer: FH; LCSC Assembly: Yes; Supplier Part: C1604; SMT Type: Basic; Package Display: Yes
C15 = 0603B103K500NT: Supplier: LCSC; Manufacturer: FH; LCSC Assembly: Yes; Supplier Part: C57112; SMT Type: Basic
U4 = HT7533-1_C14289: Supplier: LCSC; Manufacturer: HOLTEK; Manufacturer Part: HT7533-1; LCSC Assembly: Yes; image: //image.lceda.cn/szlcsc/C14289.jpg; Supplier Part: C14289; SMT Type: Basic
U5 = MPU-6050_C24112: sourceId: 1T5FDZYC8; Supplier: LCSC; Manufacturer: InvenSense; Manufacturer Part: MPU-6050; LCSC Assembly: Yes; image: //image.lceda.cn/szlcsc/C24112.jpg; Supplier Part: C24112; SMT Type: Basic

## Nets
3.3V: C10.2 C13.2 C15.2 R8.2 R9.2 U1.2(VREF1) U4.3(Vout) U5.8(VLOGIC) U5.13(VDD)
5V: C2.2 C4.2 C5.2 C6.2 C7.2 C8.2 C11.2 C17.1 J1.2(+V) JP1.4(VCC) LED1.1(VDD) LED2.1(VDD) LED3.1(VDD) LED4.1(VDD) LED5.1(VDD) LED6.1(VDD) LED7.1(VDD) LED8.1(VDD) LED9.1(VDD) LED10.1(VDD) LED11.2(+) LED13.1(VDD) LED14.1(VDD) LED15.1(VDD) LED16.1(VDD) LED17.1(VDD) LED18.1(VDD) R1.2 R6.2 R10.2 R11.2 R14.2 U2.2(VOUT) U3.4(VCC) U3.6(VCC) U3.18(AVCC) U4.2(Vin)
GND: B1.2 C1.1 C2.1 C3.1 C4.1 C5.1 C6.1 C7.1 C8.1 C9.1 C10.1 C11.1 C12.1 C13.1 C14.1 C15.1 C17.2 C18.2 C19.1 C20.1 J1.6(GND) JP1.5(CTS) JP1.6(GND) LED1.3(VSS) LED2.3(VSS) LED3.3(VSS) LED4.3(VSS) LED5.3(VSS) LED6.3(VSS) LED7.3(VSS) LED8.3(VSS) LED9.3(VSS) LED10.3(VSS) LED13.3(VSS) LED14.3(VSS) LED15.3(VSS) LED16.3(VSS) LED17.3(VSS) LED18.3(VSS) R2.1 R4.1 R12.1 R13.1 SW1.2 SW2.3(C) SW2.4(D) U1.1(GND) U2.4(PGND) U2.9(GND) U2.11(PAD) U3.3(GND) U3.5(GND) U3.21(GND) U4.1(GND) U5.1(CLKIN) U5.9(AD0) U5.11(FSYNC) U5.18(GND)
A0: U3.23(PC0(ADC0/PCINT8))
A1: U3.24(PC1(ADC1/PCINT9))
A2: U3.25(PC2(ADC2/PCINT10))
A3: U3.26(PC3(ADC3/PCINT11))
A4: R11.1 U1.5(SDA2) U3.27(PC4(ADC4/SDA/PCINT12))
A5: R10.1 U1.6(SCL2) U3.28(PC5(ADC5/SCL/PCINT13))
A6: U3.19(ADC6)
A7: U3.22(ADC7)
D0: JP1.3(RXI) U3.30(PD0(RXD/PCINT16))
D1: JP1.2(TXO) U3.31(PD1(TXD/PCINT17))
D1_OUT_D2_IN: LED1.2(DOUT) LED2.4(DIN)
D2: U3.32(PD2(INT0/PCINT18)) U5.12(INT)
D2_OUT_D3_IN: LED2.2(DOUT) LED3.4(DIN)
D3: U3.1((PCINT19/OC2B/INT1)PD3)
D3_OUT_D4_IN: LED3.2(DOUT) LED4.4(DIN)
D4: U3.2((PCINT20/XCK/T0)PD4)
D4_OUT_D5_IN: LED4.2(DOUT) LED5.4(DIN)
D5: R7.2 U3.9((PCINT21/OC0B/T1)PD5)
D5_OUT_D6_IN: LED5.2(DOUT) LED6.4(DIN)
D6: U3.10((PCINT22/OC0A/AIN0)PD6)
D6_OUT_D7_IN: LED6.2(DOUT) LED7.4(DIN)
D7: U3.11((PCINT23/AIN1)PD7)
D7_OUT_D8_IN: LED7.2(DOUT) LED8.4(DIN)
D8: U3.12((PCINT0/CLKO/ICP1)PB0)
D8_OUT_D9_IN: LED8.2(DOUT) LED9.4(DIN)
D9: U3.13((PCINT1/OC1A)PB1)
D9_OUT_D10_IN: LED9.2(DOUT) LED10.4(DIN)
D10: U3.14((PCINT2/SS#/OC1B)PB2)
D10_OUT_D11_IN: LED10.2(DOUT) LED13.4(DIN)
D11: J1.4(MOSI) U3.15((PCINT3/OC2A/MOSI)PB3)
D11_OUT_D12_IN: LED13.2(DOUT) LED14.4(DIN)
D12: J1.1(MISO) U3.16((PCINT4/MISO)PB4)
D12_OUT_D13_IN: LED14.2(DOUT) LED15.4(DIN)
D13: J1.3(SCK) LED12.2(+) U3.17(PB5(SCK/PCINT5))
D13_OUT_D14_IN: LED15.2(DOUT) LED16.4(DIN)
D14_OUT_D15_IN: LED16.2(DOUT) LED17.4(DIN)
D15_OUT_D16_IN: LED17.2(DOUT) LED18.4(DIN)
D16_OUT_D17_IN: LED18.2(DOUT)
DTR: C16.1 JP1.1(DTR)
FB: R1.1 R2.2 U2.10(FB)
L: L1.2 U2.3(L)
RESET: C16.2 J1.5(RST) R14.1 SW2.1(A) SW2.2(B) U3.29(PC6(RESET#/PCINT14))
SCL_3.3V: R8.1 U1.3(SCL1) U5.23(SCL)
SDA_3.3V: R9.1 U1.4(SDA1) U5.24(SDA)
TPS61200DRCR_EN: R5.2 SW1.1 U2.6(EN)
UVLO: R3.1 R4.2 U2.7(UVLO)
V_BATT: B1.1 C1.2 L1.1 R3.2 R5.1 U2.5(VIN) U2.8(PS)
Net-(C3-2): C3.2 U2.1(VAUX)
Net-(C9-2): C9.2 R6.1 U1.7(VREF2) U1.8(EN)
Net-(C12-2): C12.2 U5.20(CPOUT)
Net-(C14-2): C14.2 U5.10(REGOUT)
Net-(C18-1): C18.1 U3.20(AREF)
Net-(C19-2): C19.2 U3.7((PCINT6/XTAL1/TOSC1)PB6) X1.3(OSC2)
Net-(C20-2): C20.2 U3.8((PCINT7/XTAL2/TOSC2)PB7) X1.1(OSC1)
Net-(LED1-4): LED1.4(DIN) R7.1
Net-(LED11-1): LED11.1(-) R12.2
Net-(LED12-1): LED12.1(-) R13.2

Not connected (* = marked no-connect by the designer): U5 2(NC) 3(NC) 4(NC) 5(NC) 6(AUX_DA) 7(AUX_CL) 14(NC) 15(NC) 16(NC) 17(NC) 19(RESV) 21(RESV) 22(RESV) 25(EP); X1 2(GND) 4(GND)
